# Altium schematic sheet Hoja_Buck2.SchDoc: Hoja_Buck2
size A4; SheetNumber: 6; SheetTotal: 6
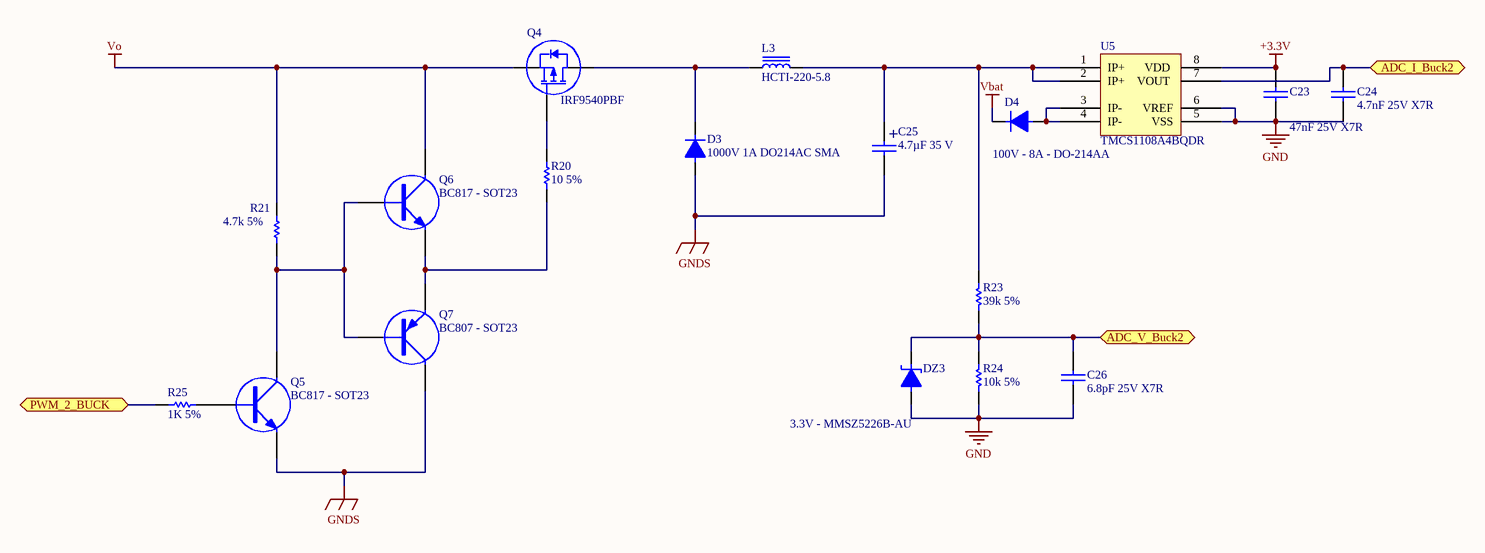
[diagram p0: Hoja_Buck2.SchDoc]

## Parts
C23  47nF 25V X7R  [0805]
C24  4.7nF 25V X7R  [0805]
C25  4.7µF 35 V  [CAPSMD8x8.3]
C26  6.8pF 25V X7R  [0805]
D3  1000V 1A DO214AC SMA  [DO-214AC]
D4  100V - 8A - DO-214AA  [SMPA-DIODE]
DZ3  3.3V - MMSZ5226B-AU  [sod123]
L3  HCTI-220-5.8  [IND_HCTI-220-5.8]
Q4  IRF9540PBF  [TO-220 V]
Q5  BC817 - SOT23  [SOT23-3]
Q6  BC817 - SOT23  [SOT23-3]
Q7  BC807 - SOT23  [SOT23-3]
R20  10 5%  [0805]
R21  4.7k 5%  [0805]
R23  39k 5%  [0805]
R24  10k 5%  [0805]
R25  1K 5%  [0805]
U5  TMCS1108A4BQDR  [SOIC8]

## Ports
ADC_I_Buck2 (bidir), ADC_V_Buck2 (bidir), PWM_2_BUCK (bidir)

## Nets
+3.3V: C23.1 U5.8(VDD)
GND: C23.2 C24.2 C26.2 DZ3.1 R24.1 U5.5(VSS) U5.6(VREF)
GNDS: C25.2 D3.1 Q5.3(E) Q7.2(C)
Vbat: D4.2
Vo: Q4.3(S) Q6.2(C) R21.1
ADC_I_Buck2: C24.1 U5.7(VOUT) ; port ADC_I_Buck2
ADC_V_Buck2: C26.1 DZ3.2 R23.1 R24.2 ; port ADC_V_Buck2
PWM_2_BUCK: R25.1 ; port PWM_2_BUCK
NetC25_1: C25.1 L3.2 R23.2 U5.1(IP+) U5.2(IP+)
NetD3_2: D3.2 L3.1 Q4.2(D)
NetD4_1: D4.1 U5.3(IP-) U5.4(IP-)
NetQ4_1: Q4.1(G) R20.1
NetQ5_1: Q5.1(B) R25.2
NetQ5_2: Q5.2(C) Q6.1(B) Q7.1(B) R21.2
NetQ6_3: Q6.3(E) Q7.3(E) R20.2

## Notes on the sheet
- Title:
- Size:
- Author:
- A4
- Sheet
- of
- Revision:
- File:
- Date:
- (in symbol CAPPOL) +

## Library data of the parts
C23 C24 C26 = CAP
C25 = CAPPOL
D3 = DIODO: Diodos Estándar 1000 V 1A Montaje en superficie SMA
D4 = DIODO
DZ3 = DIODO ZENER
L3 = INDUCTOR: https://ar.mouser.com/datasheet/2/643/ds-st-high-current-torodial-inductors-series-1661536.pdf
Q4 = MOSFET P
Q5 Q6 = TRANSISTOR NPN: 45V NPN SMALL SIGNAL TRANSISTOR IN SOT23
Q7 = TRANSISTOR PNP: Transistor PNP, Ic 500mA, Vceo -45 Vdc. Empaque SOT23. De montaje superficial. Trabaja hasta mínimo 100MHz.
R20 R21 R23-R25 = RES
U5 = MLX91221KDC: Sensores de corriente 1 canal Efecto Hall Bidireccional 8-SOIC (ancho 0.154", 3.90mm)